# EAGLE design TinyGame RC1 (EAGLE 6.5.0)
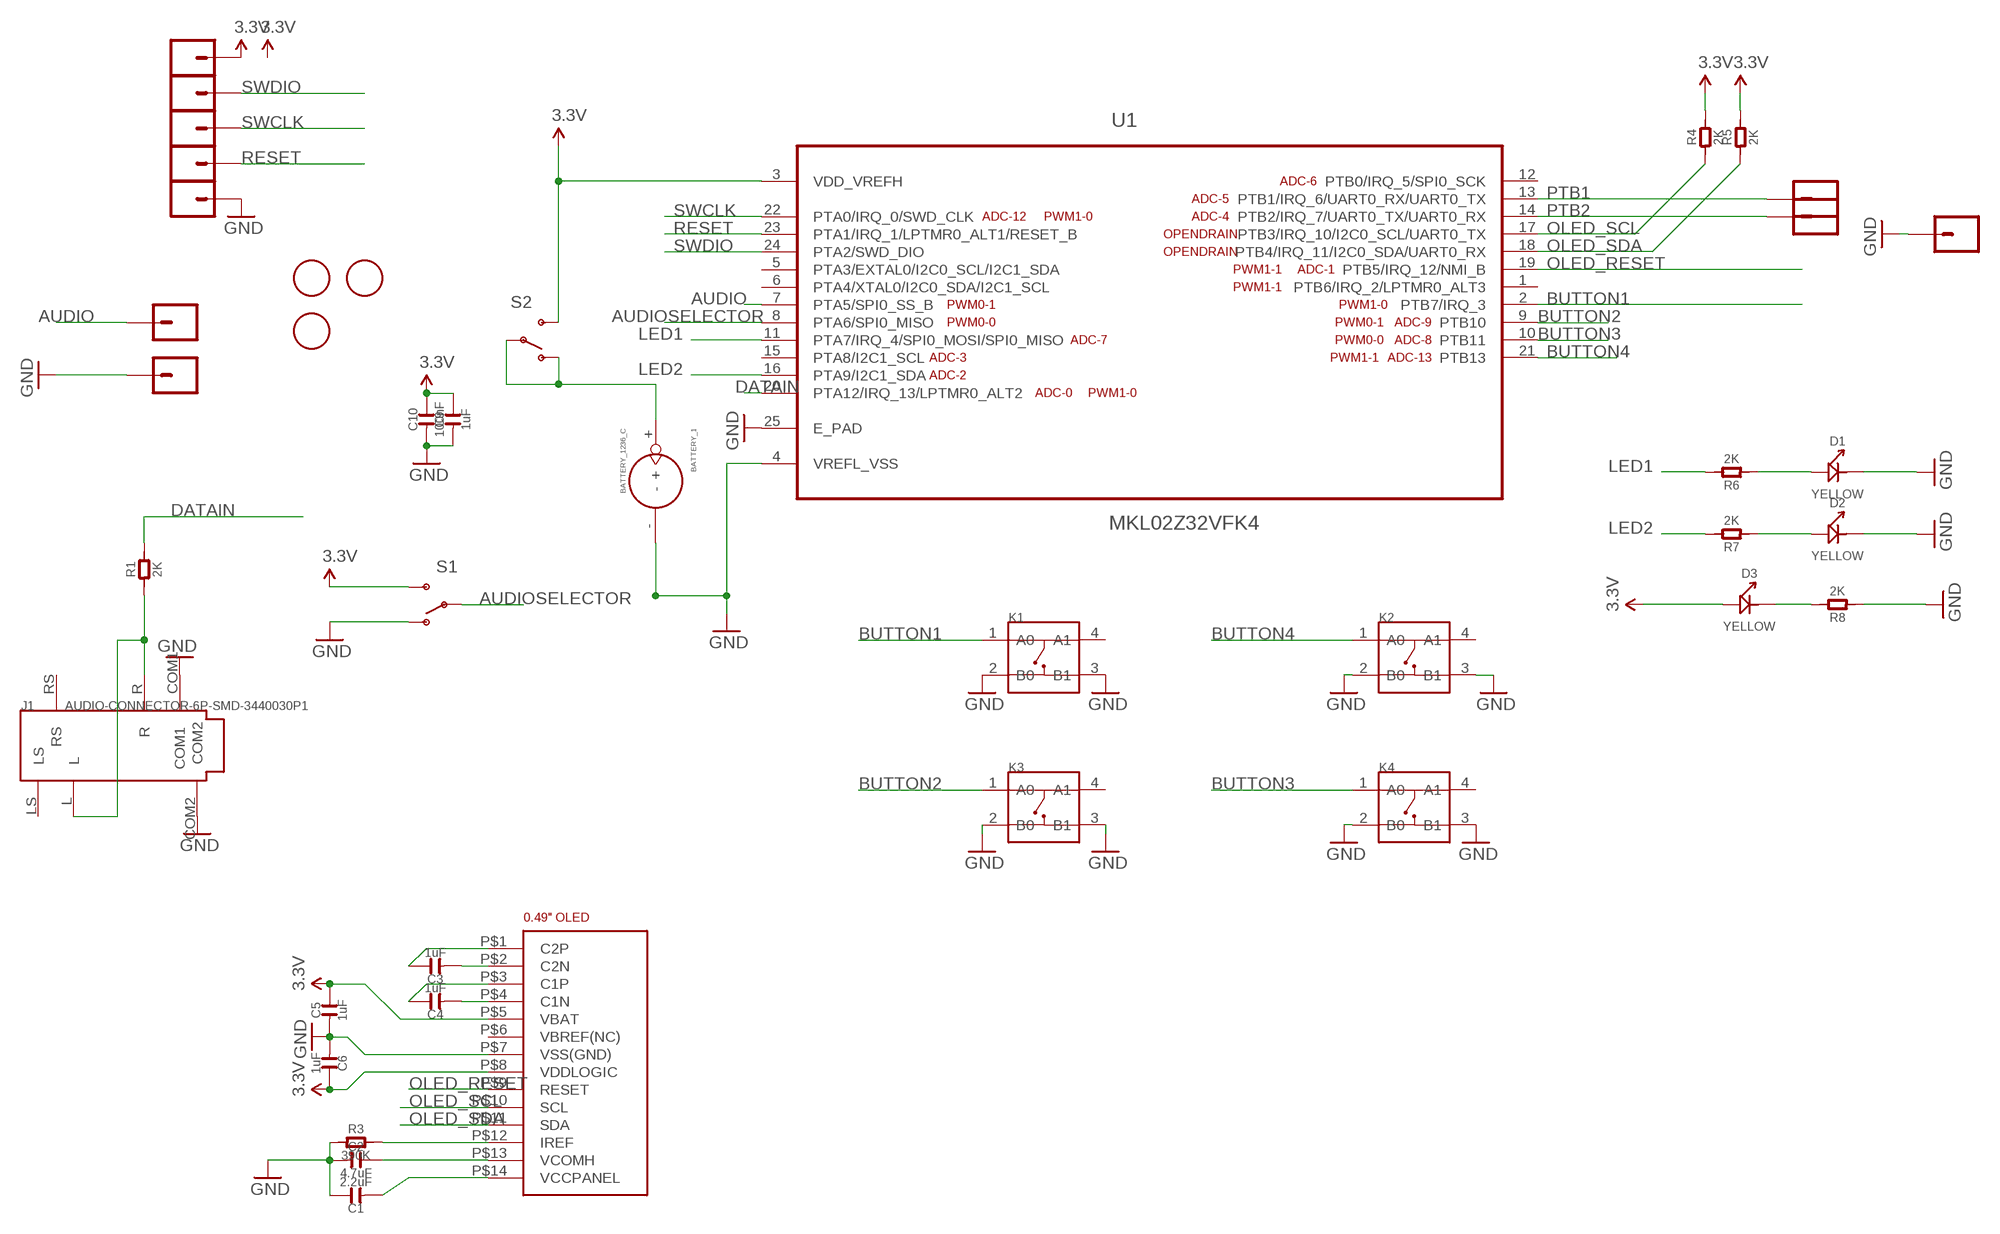
[diagram p0: schematic, sheet 1]

## Parts
AUDIOGND  M01SMD-4.5X1.5  [PAD-1.5X4.5]
AUDIOSIG  M01SMD-4.5X1.5  [PAD-1.5X4.5]
BATTERY_1  BATTERY_1236_C  [BATTERY_1236_C]
C1  2.2uF  C-0603  [C0603]
C2  4.7uF  C-0603  [C0603]
C3  1uF  C-0603  [C0603]
C4  1uF  C-0603  [C0603]
C5  1uF  C-0603  [C0603]
C6  1uF  C-0603  [C0603]
C9  1uF  C-0603  [C0603]
C10  100nF  C-0603  [C0603]
D1  YELLOW  LED  [LED0603]
D2  YELLOW  LED  [LED0603]
D3  YELLOW  LED  [LED0603]
J1  AUDIO-CONNECTOR-6P-SMD-3440030P1  [6P-SMD-3.5]
K1  BUTTON-4P-3100010P1  [4P-SMD-6.0X6.0X5.0H]
K2  BUTTON-4P-3100010P1  [4P-SMD-6.0X6.0X5.0H]
K3  BUTTON-4P-3100010P1  [4P-SMD-6.0X6.0X5.0H]
K4  BUTTON-4P-3100010P1  [4P-SMD-6.0X6.0X5.0H]
PTA6_MISO1  M01SMD-4.5X1.5  [PAD-1.5X4.5]
PTA6_MISO2  M01SMD-4.5X1.5  [PAD-1.5X4.5]
PTA6_MISO3  M01SMD-4.5X1.5  [PAD-1.5X4.5]
PTA6_MISO4  M01SMD-4.5X1.5  [PAD-1.5X4.5]
PTA6_MISO5  M01SMD-4.5X1.5  [PAD-1.5X4.5]
PTB1_RXTX  M01SMD-4.5X1.5  [PAD-1.5X4.5]
PTB2_TXRX  M01SMD-4.5X1.5  [PAD-1.5X4.5]
PTB2_TXRX2  M01SMD-4.5X1.5  [PAD-1.5X4.5]
R1  2K  R-0603  [R0603]
R3  390K  R-0603  [R0603]
R4  2K  R-0603  [R0603]
R5  2K  R-0603  [R0603]
R6  2K  R-0603  [R0603]
R7  2K  R-0603  [R0603]
R8  2K  R-0603  [R0603]
S1  SWITCH-SPDT-SMD-A  [SWITCH-SPST-SMD-A]
S2  SWITCH-SPDT-SMD-A  [SWITCH-SPST-SMD-A]
U1  MKL02Z32VFK4  [QFN50P400X400X100-25N]
U$1  0.49"OLEDFOLDED  [0.49"-FPC-0.7-14-FOLDED]
U$2  FIDUCIAL  [FIDUCIAL_1MM]
U$3  FIDUCIAL  [FIDUCIAL_1MM]
U$4  FIDUCIAL  [FIDUCIAL_1MM]

## Nets
3.3V: C5.2 C6.2 C9.2 C10.2 D3.+ PTA6_MISO1.P$1 R4.2 R5.2 S1.3(S) S2.3(S) U1.3(VDD_VREFH) U$1.P$5(VBAT) U$1.P$8(VDDLOGIC)
AUDIO: AUDIOSIG.P$1 U1.7(PTA5/SPI0_SS_B)
AUDIOSELECTOR: S1.2(P) U1.8(PTA6/SPI0_MISO)
BUTTON1: K1.1(A0) U1.2(PTB7/IRQ_3)
BUTTON2: K3.1(A0) U1.9(PTB10)
BUTTON3: K4.1(A0) U1.10(PTB11)
BUTTON4: K2.1(A0) U1.21(PTB13)
DATAIN: R1.2 U1.20(PTA12/IRQ_13/LPTMR0_ALT2)
GND [GND]: AUDIOGND.P$1 BATTERY_1.- C1.2 C2.1 C5.1 C6.1 C9.1 C10.1 D1.- D2.- J1.COM1 J1.COM2 K1.2(B0) K1.3(B1) K2.2(B0) K2.3(B1) K3.2(B0) K3.3(B1) K4.2(B0) K4.3(B1) PTA6_MISO5.P$1 PTB2_TXRX2.P$1 R3.1 R8.1 S1.1(O) U1.4(VREFL_VSS) U1.25(E_PAD) U$1.P$7(VSS(GND))
LED1: R6.2 U1.11(PTA7/IRQ_4/SPI0_MOSI/SPI0_MISO)
LED2: R7.2 U1.16(PTA9/I2C1_SDA)
N$2: J1.L J1.R R1.1
N$3: C3.2 U$1.P$1(C2P)
N$4: C4.2 U$1.P$3(C1P)
N$6: D1.+ R6.1
N$9: R3.2 U$1.P$12(IREF)
N$10: C1.1 U$1.P$14(VCCPANEL)
N$11: C2.2 U$1.P$13(VCOMH)
N$12: C3.1 U$1.P$2(C2N)
N$13: C4.1 U$1.P$4(C1N)
N$14: D2.+ R7.1
N$19: D3.- R8.2
N$20: BATTERY_1.+ S2.1(O) S2.2(P)
OLED_RESET: U1.19(PTB5/IRQ_12/NMI_B) U$1.P$9(RESET)
OLED_SCL: R4.1 U1.17(PTB3/IRQ_10/I2C0_SCL/UART0_TX) U$1.P$10(SCL)
OLED_SDA: R5.1 U1.18(PTB4/IRQ_11/I2C0_SDA/UART0_RX) U$1.P$11(SDA)
PTB1: PTB1_RXTX.P$1 U1.13(PTB1/IRQ_6/UART0_RX/UART0_TX)
PTB2: PTB2_TXRX.P$1 U1.14(PTB2/IRQ_7/UART0_TX/UART0_RX)
RESET: PTA6_MISO4.P$1 U1.23(PTA1/IRQ_1/LPTMR0_ALT1/RESET_B)
SWCLK: PTA6_MISO3.P$1 U1.22(PTA0/IRQ_0/SWD_CLK)
SWDIO: PTA6_MISO2.P$1 U1.24(PTA2/SWD_DIO)
Unconnected: J1.LS J1.RS K1.4(A1) K2.4(A1) K3.4(A1) K4.4(A1) U1.1(PTB6/IRQ_2/LPTMR0_ALT3) U1.5(PTA3/EXTAL0/I2C0_SCL/I2C1_SDA) U1.6(PTA4/XTAL0/I2C0_SDA/I2C1_SCL) U1.12(PTB0/IRQ_5/SPI0_SCK) U1.15(PTA8/I2C1_SCL) U$1.P$6(VBREF(NC))

## Library data of the parts
AUDIOGND AUDIOSIG PTA6_MISO1-PTA6_MISO5 PTB1_RXTX PTB2_TXRX PTB2_TXRX2 = SparkFun-Connectors:M01: Header 1 Standard 1-pin 0.1" header. Use with straight break away headers (SKU : PRT-00116), right angle break away headers (PRT-00553), swiss pins (PRT-00743), machine pins (PRT-00117), and female headers (PRT-00115).
BATTERY_1 = MicroGameboyParts:BATTERY_1236_C: SOC004
C1-C6 C9 C10 = OPL:C*
D1-D3 = OPL:LED*: LED
J1 = OPL:AUDIO-CONNECTOR-6P-SMD
K1-K4 = zephod-components:BUTTON-4P
R1 R3-R8 = OPL:R*
S1 S2 = SparkFun-Electromechanical:SWITCH-SPDT: SPDT Switch Simple slide switch, Spark Fun Electronics SKU : COM-00102 DPDT SMT slide switch, AYZ0202, SWCH-08179
U1 = FarnellThings:MKL02Z32VFK4: IC, MCU, 32BIT, CORTEX M0+, 48MHZ, QFN-24; MPN: MKL02Z32VFK4; OC_FARNELL: 2321481; OC_NEWARK: 61W9887; PACKAGE: QFN-24; SUPPLIER: FREESCALE SEMICONDUCTOR
U$1 = zephod-tft:0.49"OLED
U$2-U$4 = adafruit:FIDUCIAL: For use by pick and place machines to calibrate the vision/machine, 1mm By microbuilder.eu

## Net classes
0 default: clearance 0.178 mm
1 GND: width 0.203 mm, drill 0.203 mm, clearance 0.203 mm

## Board
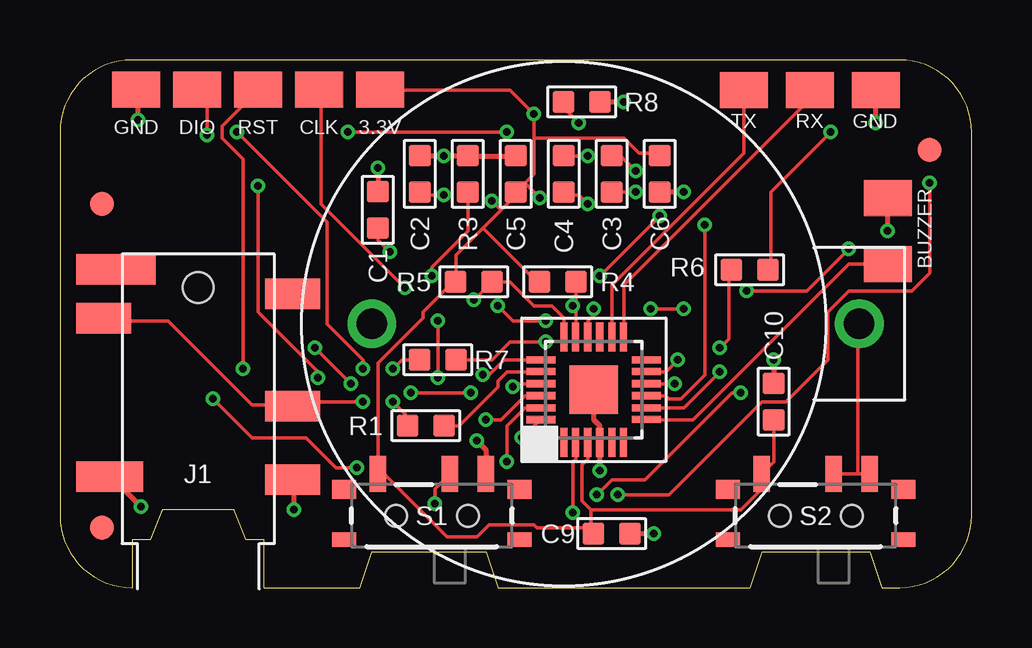
[diagram p1: board, top side]
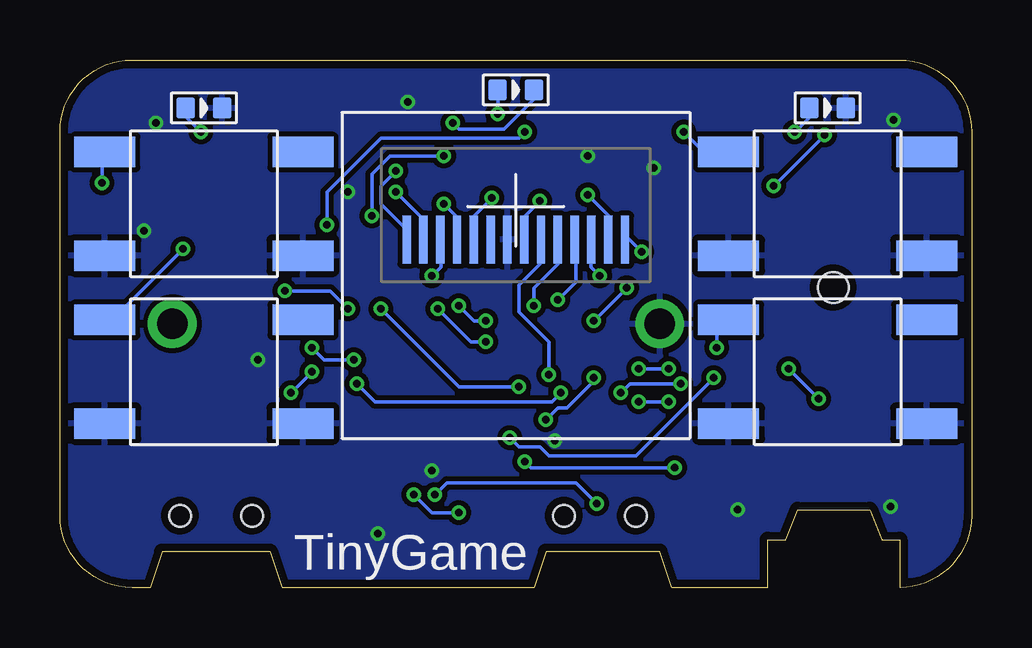
[diagram p2: board, bottom side, seen from below]

Size 38 x 22 mm. Coordinates in mm from the lower left corner, seen from the top.
Outline: 38,3 38,19 arc90 35,22 3,22 arc90 0,19 0,3 arc90 3,0 3,2 3.75,2 4.25,3.25 7.25,3.25 7.75,2 8.5,2 8.5,0 12.5,0 13,1.5 17.75,1.5 18.25,0 28.75,0 29.25,1.5 33.75,1.5 34.25,0 35,0 arc90 38,3
Copper layers (1*16): Top 0.035mm / dielectric 1.5mm / Bottom 0.035mm
Design rules "ITEADstudio_DRC *": minimum track width 6mil, minimum drill 12mil, track to track 6mil, track to pad 6mil, pad to pad 6mil, via to via 6mil, smd to smd 0mil, copper to edge 13mil, drill to drill 10mil, minimum pad ring 10mil, minimum via ring 6mil, stop-mask expansion 2mil, vias tented up to drill 100mil, thermal gap 10mil

### Footprints (pad centres in the part's own frame; a part is rotated, then mirrored left to right if it is on the bottom)
PAD-1.5X4.5 = smd 1.5 x 2: P$1 0,0
BATTERY_1236_C = drill 1.27 pad 2.032: + 0,-12.319; - 0,8.001
C0603 = smd 0.889 x 0.889: 1 -0.762,0; 2 0.762,0
LED0603 = smd 0.762 x 0.889: + -0.762,0; - 0.762,0
6P-SMD-3.5 = smd 1.27 x 2.286: COM1 2.413,3.937; L -4.318,-3.937; R -0.635,3.937; RS -5.334,3.937 | smd 1.27 x 2.794: COM2 2.286,-3.683 | smd 1.27 x 3.302: LS -6.35,-3.429 | hole 1.27: -5.588,0
4P-SMD-6.0X6.0X5.0H = smd 2.54 x 1.27: 1 -4.129,2.159; 2 -4.129,-2.159; 3 4.129,-2.159; 4 4.129,2.159
R0603 = smd 0.889 x 0.889: 1 -0.762,0; 2 0.762,0
SWITCH-SPST-SMD-A = smd 0.7 x 1.5: 1 -2.25,-1.75; 2 -0.75,-1.75; 3 2.25,-1.75 | smd 1 x 0.6: GND1 -3.65,1; GND3 3.65,1 | smd 1 x 0.8: GND2 -3.65,-1.1; GND4 3.65,-1.1 | hole 0.9: -1.5,0; 1.5,0
QFN50P400X400X100-25N = smd 1.2 x 0.3: 1 -2.2,1.245; 2 -2.2,0.762; 3 -2.2,0.254; 4 -2.2,-0.254; 5 -2.2,-0.762; 6 -2.2,-1.245; 13 2.2,-1.245; 14 2.2,-0.762; 15 2.2,-0.254; 16 2.2,0.254; 17 2.2,0.762; 18 2.2,1.245 | smd 0.3 x 1.2: 7 -1.245,-2.2; 8 -0.762,-2.2; 9 -0.254,-2.2; 10 0.254,-2.2; 11 0.762,-2.2; 12 1.245,-2.2; 19 1.245,2.2; 20 0.762,2.2; 21 0.254,2.2; 22 -0.254,2.2 | smd 0.305 x 1.2: 23 -0.762,2.2; 24 -1.245,2.2 | smd 2.032 x 2.032: 25 0,0
0.49"-FPC-0.7-14-FOLDED = smd 0.35 x 2: P$1 -4.55,-1.49; P$2 -3.85,-1.49; P$3 -3.15,-1.49; P$4 -2.45,-1.49; P$5 -1.75,-1.49; P$6 -1.05,-1.49; P$7 -0.35,-1.49; P$8 0.35,-1.49; P$9 1.05,-1.49; P$10 1.75,-1.49; P$11 2.45,-1.49; P$12 3.15,-1.49; P$13 3.85,-1.49; P$14 4.55,-1.49
FIDUCIAL_1MM = smd 1 x 1: 1 0,0

### Placement (x,y rotation side)
AUDIOGND  34.5,16.25 90 top
AUDIOSIG  34.5,13.5 90 top
BATTERY_1  21,11 90 top
C1  13.25,15.75 90 top
C2  15,17.25 270 top
C3  23,17.25 90 top
C4  21,17.25 90 top
C5  19,17.25 270 top
C6  25,17.25 90 top
C9  23,2.25 180 top
C10  29.75,7.75 270 top
D1  32,20 0 bottom
D2  6,20 0 bottom
D3  19,20.75 0 bottom
J1  5.76,6.92 270 top
K1  32,16 0 bottom
K2  32,9 0 bottom
K3  6,16 0 bottom
K4  6,9 0 bottom
PTA6_MISO1  13.34,20.77 90 top
PTA6_MISO2  5.71,20.77 90 top
PTA6_MISO3  10.79,20.77 90 top
PTA6_MISO4  8.26,20.77 90 top
PTA6_MISO5  3.17,20.77 90 top
PTB1_RXTX  31.25,20.75 270 top
PTB2_TXRX  28.5,20.75 270 top
PTB2_TXRX2  34,20.75 270 top
R1  15.25,6.75 0 top
R3  17,17.25 270 top
R4  20.75,12.75 180 top
R5  17.25,12.75 180 top
R6  28.75,13.25 180 top
R7  15.75,9.5 0 top
R8  21.75,20.25 180 top
S1  15.5,3 180 top
S2  31.5,3 180 top
U1  22.25,8.25 90 top
U$1  19,16 0 bottom
U$2  1.75,16 0 top
U$3  1.75,2.5 0 top
U$4  36.25,18.25 0 top

### Tracks (layer width: path | path; a pad name or v marks a point on that pad's centre or on a via)
3.3V  (via drill 0.3)
  Top 0.152: C10.2 29.75,5.25 S2.3 29.25,4.12 28.38,3.25 22.12,3.25 | 22.12,3.25 22.12,2.5 | 22.12,2.5 22.12,2.25 C9.2 22.12,2.5 | 22.12,3.25 21.75,3.62 21.75,5.12 22,5.38 22,6 U1.3 | 18.38,15.75 19,16.38 C5.2 | 18.38,15.75 17.62,15 | 17.62,15 16.5,13.88 R5.2 16.38,12.75 15.12,11.5 15.12,11.25 13.25,9.38 13.25,5 | 19.75,18.75 19.75,17.25 19.38,16.88 | 19.75,18.75 v19.75,19.75 18.75,20.75 13.38,20.75 PTA6_MISO1.P$1 | 19.38,16.88 C5.2 | 17.62,15 19.88,12.75 R4.2 | 19.75,18.75 23.5,18.75 24.12,18.12 25,18.12 C6.2 | 18.38,15.75 v18,16.12 | 19.38,16.88 v20,16.25 | 19.38,16.88 C5.2 | 22.12,2.5 19.88,2.5 19.75,2.62 17.88,2.62 17.38,2.12 16.12,2.12 13.25,5 | 13.25,5 S1.3
  Bottom 0.152: v19.75,19.75 D3.+ | v18,16.12 18.62,15.5 18.62,14.62 U$1.P$8 | U$1.P$5 20.75,15.5 v20,16.25
AUDIO
  Top 0.152: AUDIOSIG.P$1 32.88,13.5 26.38,7 24.5,7 U1.7
AUDIOSELECTOR  (via drill 0.3)
  Top 0.152: v27.5,9 26,7.5 24.5,7.5 U1.8 | v28.38,8.12 28,8.12 24.38,4.5 23,4.5 v22.38,3.88 | v15.62,3.5 15.62,4.12 S1.2
  Bottom 0.152: v28.38,8.12 v27.5,9 | v22.38,3.88 21.88,4.38 16.5,4.38 v15.62,3.5
BUTTON1  (via drill 0.3)
  Top 0.152: v21.38,3.12 21.38,5.25 21.5,5.38 21.5,6 U1.2 | v23.25,3.88 25.38,3.88 29.25,7.75 30.25,7.75 32,9.5 32,11.5 32.88,12.38 35.5,12.38 36.25,13.12 v36.25,16.88
  Bottom 0.152: v21.38,3.12 22.5,3.12 v23.25,3.88 | v36.25,16.88 36.25,18.12 K1.1
BUTTON2  (via drill 0.3)
  Top 0.152: v26.88,15.12 26.88,8.88 25.88,7.88 25.38,7.88 25.25,8 24.5,8 U1.9 | v12,19 v18.62,19
  Bottom 0.152: v26.88,15.12 26.88,16.5 24.62,18.75 18.88,18.75 v18.62,19 | v12,19 11.25,18.25 10.25,18.25 K3.1
BUTTON3  (via drill 0.3)
  Top 0.152: v25.62,8.5 24.5,8.5 U1.10 | v14.62,8.12 v17.12,8.12 | v10.62,10 v12.12,8.5
  Bottom 0.152: v25.62,8.5 24.88,7.75 17.5,7.75 v17.12,8.12 | v14.62,8.12 14.25,8.5 v12.12,8.5 | v10.62,10 10.62,10.75 10.25,11.12 K4.1
BUTTON4  (via drill 0.3)
  Top 0.152: v18.88,8.38 19,8.5 20,8.5 U1.21 | v26,11.62 v24.62,11.62 | v28.62,12.38 31.12,12.38 v32.88,14.12
  Bottom 0.152: v18.88,8.38 21.38,8.38 v24.62,11.62 | v26,11.62 26.75,12.38 v28.62,12.38 | v32.88,14.12 35.75,11.25 36.12,11.25 K2.1
DATAIN
  Top 0.152: R1.2 16.62,6.75 18.25,8.38 18.25,8.62 18.62,9 20,9 U1.20
GND  (via drill 0.3)
  Top 0.203: R3.1 v16,18 C2.1 | R3.1 C5.1 | R3.1 | v24.75,2.25 C9.1 | v29.75,9.5 C10.1 | v13.25,17.5 C1.2 | v23.5,20.25 R8.1 | v26,16.5 C6.1 | v22.5,4.88 22.5,6 U1.4 22.5,6.12 22.5,6.75 22.25,7 U1.25 | S1.1 17.75,5.75 v17.38,6.12 | v3.25,19.5 3.25,20.75 PTA6_MISO5.P$1 | v34.5,14.88 AUDIOGND.P$1 | v34,19.38 PTB2_TXRX2.P$1 | v9.75,3.25 9.75,4.5 J1.COM1 | v3.38,3.38 2.12,4.62 J1.COM2
  pour Bottom: 0,3 0,19 arc-90 3,22 35,22 arc-90 38,19 38,3 arc-90 35,0 3,0 arc-90
LED1  (via drill 0.3)
  Top 0.152: v27.5,10 27.88,10.38 27.88,13.25 R6.2 | v25.75,9.5 25.25,9 24.5,9 U1.11
  Bottom 0.152: v27.5,10 27,9.5 v25.75,9.5
LED2  (via drill 0.3)
  Top 0.152: R7.2 18,9.5 18.75,10.25 v20.25,10.25 | v22.25,11.62 22.25,11.38 22,11.12 22,10.5 U1.16
  Bottom 0.152: v20.25,10.25 20.88,10.25 v22.25,11.62
N$2  (via drill 0.3)
  Top 0.152: v13.88,7.75 14.38,7.25 14.38,6.75 R1.1 | v12.62,7.75 9.88,7.75 9.75,7.62 J1.R 9.62,7.62 8,7.62 4.5,11.12 1.88,11.12 J1.L
  Bottom 0.152: v12.62,7.75 v13.88,7.75
N$3  (via drill 0.3)
  Top 0.152: v24,17.38 23.38,18 C3.2
  Bottom 0.152: v24,17.38 24.62,16.75 24.62,16 23.62,15 23.62,14.62 U$1.P$1
N$4  (via drill 0.3)
  Top 0.152: v22,18 C4.2 | v22.5,13 v25,15.5
  Bottom 0.152: v22,18 24.25,18 25,17.25 v25,15.5 | v22.5,13 22.12,13.38 22.12,14.5 U$1.P$3
N$6  (via drill 0.3)
  Top 0.152: v32.12,19 29.62,16.5 29.62,13.25 R6.1
  Bottom 0.152: v32.12,19 32.75,19.62 D1.+
N$9  (via drill 0.3)
  Top 0.152: R3.2 17,14.88 15.5,13.38 v15.5,13
  Bottom 0.152: v15.5,13 15.88,13.38 15.88,14.5 U$1.P$12
N$10  (via drill 0.3)
  Top 0.152: C1.1 13.25,14.5 v13.75,14
  Bottom 0.152: v13.75,14 14.38,14.62 U$1.P$14
N$11  (via drill 0.3)
  Top 0.152: v16,16.38 15,16.38 C2.2
  Bottom 0.152: v16,16.38 15.12,15.5 15.12,14.62 U$1.P$13
N$12  (via drill 0.3)
  Top 0.152: v24,16.5 C3.1
  Bottom 0.152: v24,16.5 22.88,15.38 22.88,14.62 U$1.P$2
N$13  (via drill 0.3)
  Top 0.152: v22,16 21.62,16.38 21,16.38 C4.1
  Bottom 0.152: v22,16 21.5,15.5 21.5,14.62 U$1.P$4
N$14  (via drill 0.3)
  Top 0.152: R7.1 14.25,9.5 v13.88,9.12 | v12.62,9.12 12.62,9.5 11.12,11 11.12,15.25 v7.38,19
  Bottom 0.152: v12.62,9.12 v13.88,9.12 | v7.38,19 6.75,19.62 D2.+
N$19  (via drill 0.3)
  Top 0.152: v21.62,19.38 21,20 R8.2
  Bottom 0.152: v21.62,19.38 21.38,19.12 19.5,19.12 18.25,20.38 D3.-
N$20
  Top 0.152: S2.1 33.25,4.75 | 33.25,4.75 S2.2 | 33.25,4.75 33.25,11 BATTERY_1.+
OLED_RESET  (via drill 0.3)
  Top 0.152: v17.62,8.88 17.88,8.88 18.5,9.5 20,9.5 U1.19
  Bottom 0.152: v17.62,8.88 17.62,10.25 18.88,11.5 18.88,12.62 18,13.5 18,14.5 U$1.P$9
OLED_SCL  (via drill 0.3)
  Top 0.152: 21.5,11.75 21.5,10.5 U1.17 | 21.5,11.75 R4.1 | v21.38,11.75 21.5,11.75 | v20.25,11.12 18.88,11.12 v18.25,11.75
  Bottom 0.152: v21.38,11.75 20.75,11.12 v20.25,11.12 | v18.25,11.75 18.25,12.5 17.25,13.5 U$1.P$10
OLED_SDA  (via drill 0.3)
  Top 0.152: U1.18 21,10.5 21,11.25 20.5,11.75 19.75,11.75 18.75,12.75 R5.1 v17.25,12
  Bottom 0.152: v17.25,12 16.5,12.75 16.5,14.5 U$1.P$11
PTB1
  Top 0.152: PTB1_RXTX.P$1 31.25,20.38 23.5,12.62 23.5,10.5 U1.13
PTB2
  Top 0.152: PTB2_TXRX.P$1 28.5,18.12 23,12.62 23,10.5 U1.14
RESET  (via drill 0.3)
  Top 0.152: v18.62,5.25 18.62,6.75 19.38,7.5 20,7.5 U1.23 | v12.38,5 11.5,5 10.25,6.25 8,6.25 v6.38,7.88 | v7.62,9.12 7.62,17.88 6.75,18.75 6.75,19.25 8.25,20.75 PTA6_MISO4.P$1
  Bottom 0.152: v18.62,5.25 18.38,5 v12.38,5 | v7.62,9.12 v6.38,7.88
SWCLK  (via drill 0.3)
  Top 0.152: v17.75,7 18.38,7 19.38,8 20,8 U1.22 | v15.75,11.12 v15.75,8.75 | v14.38,12.5 10.88,16 10.88,20.75 PTA6_MISO3.P$1
  Bottom 0.152: v17.75,7 17.25,7.5 16.88,7.5 15.75,8.62 v15.75,8.75 | v14.38,12.5 v15.75,11.12
SWDIO  (via drill 0.3)
  Top 0.152: v19.25,6.25 20,7 U1.24 | v10.75,8.75 10.75,9 8.25,11.5 v8.25,16.75 | v6.12,18.88 6.12,20.38 5.75,20.75 PTA6_MISO2.P$1
  Bottom 0.152: v19.25,6.25 18.88,5.88 18,5.88 17.62,5.5 14,5.5 v10.75,8.75 | v6.12,18.88 v8.25,16.75

### Text on the board
tPlace: TX | RX | GND | GND | DIO | RST | CLK | 3.3V | BUZZER
bPlace: TinyGame